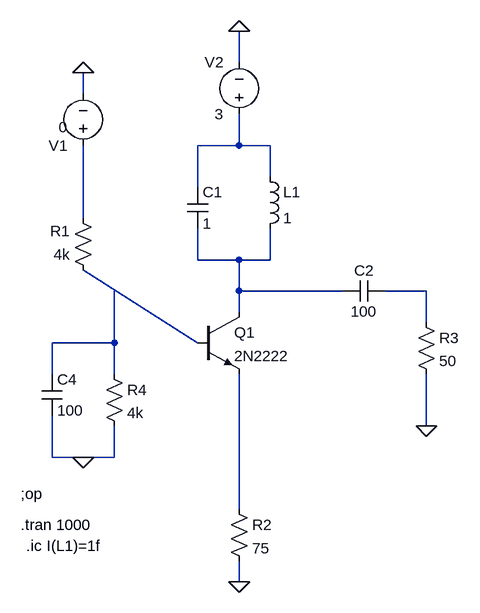
[diagram p0: schematic osc-int.asc]
osc-int.asc, the LTspice schematic file:
Version 4
SHEET 1 880 680
WIRE 192 -304 192 -352
WIRE -48 -256 -48 -288
WIRE 192 -176 192 -224
WIRE 192 -176 128 -176
WIRE 240 -176 192 -176
WIRE 240 -128 240 -176
WIRE 128 -112 128 -176
WIRE -48 -64 -48 -176
WIRE 128 0 128 -48
WIRE 192 0 128 0
WIRE 240 0 240 -48
WIRE 240 0 192 0
WIRE 192 48 192 0
WIRE 352 48 192 48
WIRE 480 48 416 48
WIRE 192 80 192 48
WIRE 480 96 480 48
WIRE 0 128 0 48
WIRE 0 128 -96 128
WIRE 128 128 -48 16
WIRE -96 176 -96 128
WIRE 0 176 0 128
WIRE 480 256 480 176
WIRE -96 304 -96 240
WIRE -48 304 -96 304
WIRE 0 304 0 256
WIRE 0 304 -48 304
WIRE 192 384 192 176
WIRE 192 496 192 464
FLAG 192 -352 0
FLAG -48 -288 0
FLAG 192 496 0
FLAG 480 256 0
FLAG -48 304 0
SYMBOL npn 128 80 R0
SYMATTR InstName Q1
SYMATTR Value 2N2222
SYMBOL res -32 32 R180
WINDOW 0 36 76 Left 2
WINDOW 3 36 40 Left 2
SYMATTR InstName R1
SYMATTR Value 4k
SYMBOL voltage -48 -160 R180
WINDOW 3 24 44 Left 2
WINDOW 123 0 0 Left 0
WINDOW 39 0 0 Left 0
SYMATTR Value 0
SYMATTR InstName V1
SYMBOL voltage 192 -208 R180
WINDOW 0 24 96 Left 2
WINDOW 3 24 16 Left 2
WINDOW 123 0 0 Left 0
WINDOW 39 0 0 Left 0
SYMATTR InstName V2
SYMATTR Value 3
SYMBOL res 176 368 R0
SYMATTR InstName R2
SYMATTR Value 75
SYMBOL ind 224 -144 R0
SYMATTR InstName L1
SYMATTR Value 1
SYMBOL cap 112 -112 R0
SYMATTR InstName C1
SYMATTR Value 1
SYMBOL cap 352 64 R270
WINDOW 0 32 32 VTop 2
WINDOW 3 0 32 VBottom 2
SYMATTR InstName C2
SYMATTR Value 100
SYMBOL res 464 80 R0
SYMATTR InstName R3
SYMATTR Value 50
SYMBOL res -16 160 R0
SYMATTR InstName R4
SYMATTR Value 4k
SYMBOL cap -112 176 R0
SYMATTR InstName C4
SYMATTR Value 100
TEXT -144 360 Left 2 !;op
TEXT -144 408 Left 2 !.tran 1000
TEXT -136 440 Left 2 !.ic I(L1)=1f

The netlist it stands for:
* osc-int.asc
Q1 N003 N006 N007 0 2N2222
R1 N006 N002 4k
V1 N002 0 0
V2 N001 0 3
R2 N007 0 75
L1 N001 N003 1
C1 N001 N003 1
C2 N003 N004 100
R3 N004 0 50
R4 N005 0 4k
C4 N005 0 100
.model NPN NPN
.model PNP PNP
.lib standard.bjt
;op
.tran 1000
.ic I(L1)=1f
.backanno
.end